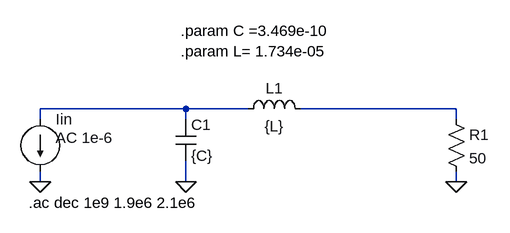
[diagram p0: schematic circuito.asc]
circuito.asc, the LTspice schematic file:
Version 4
SHEET 1 880 680
WIRE 0 144 -224 144
WIRE 96 144 0 144
WIRE 416 144 176 144
WIRE -224 160 -224 144
WIRE 0 160 0 144
WIRE 416 160 416 144
WIRE -224 256 -224 240
WIRE 0 256 0 224
WIRE 416 256 416 240
FLAG -224 256 0
FLAG 0 256 0
FLAG 416 256 0
SYMBOL cap -16 160 R0
SYMATTR InstName C1
SYMATTR Value {C}
SYMBOL ind 80 160 R270
WINDOW 0 32 56 VTop 2
WINDOW 3 5 56 VBottom 2
SYMATTR InstName L1
SYMATTR Value {L}
SYMATTR SpiceLine Rser=1e-9
SYMBOL current -224 160 R0
WINDOW 123 24 28 Left 2
WINDOW 39 24 56 Left 2
SYMATTR InstName Iin
SYMATTR Value ""
SYMATTR Value2 AC 1e-6
SYMBOL res 400 144 R0
SYMATTR InstName R1
SYMATTR Value 50
TEXT -242 288 Left 2 !.ac dec 1e9 1.9e6 2.1e6
TEXT -8 24 Left 2 !.param C =3.469e-10 \n.param L= 1.734e-05

The netlist it stands for:
* circuito.asc
C1 N001 0 {C}
L1 N001 N002 {L} Rser=1e-9
Iin N001 0 AC 1e-6
R1 N002 0 50
.ac dec 1e9 1.9e6 2.1e6
.param C =3.469e-10
.param L= 1.734e-05
.backanno
.end